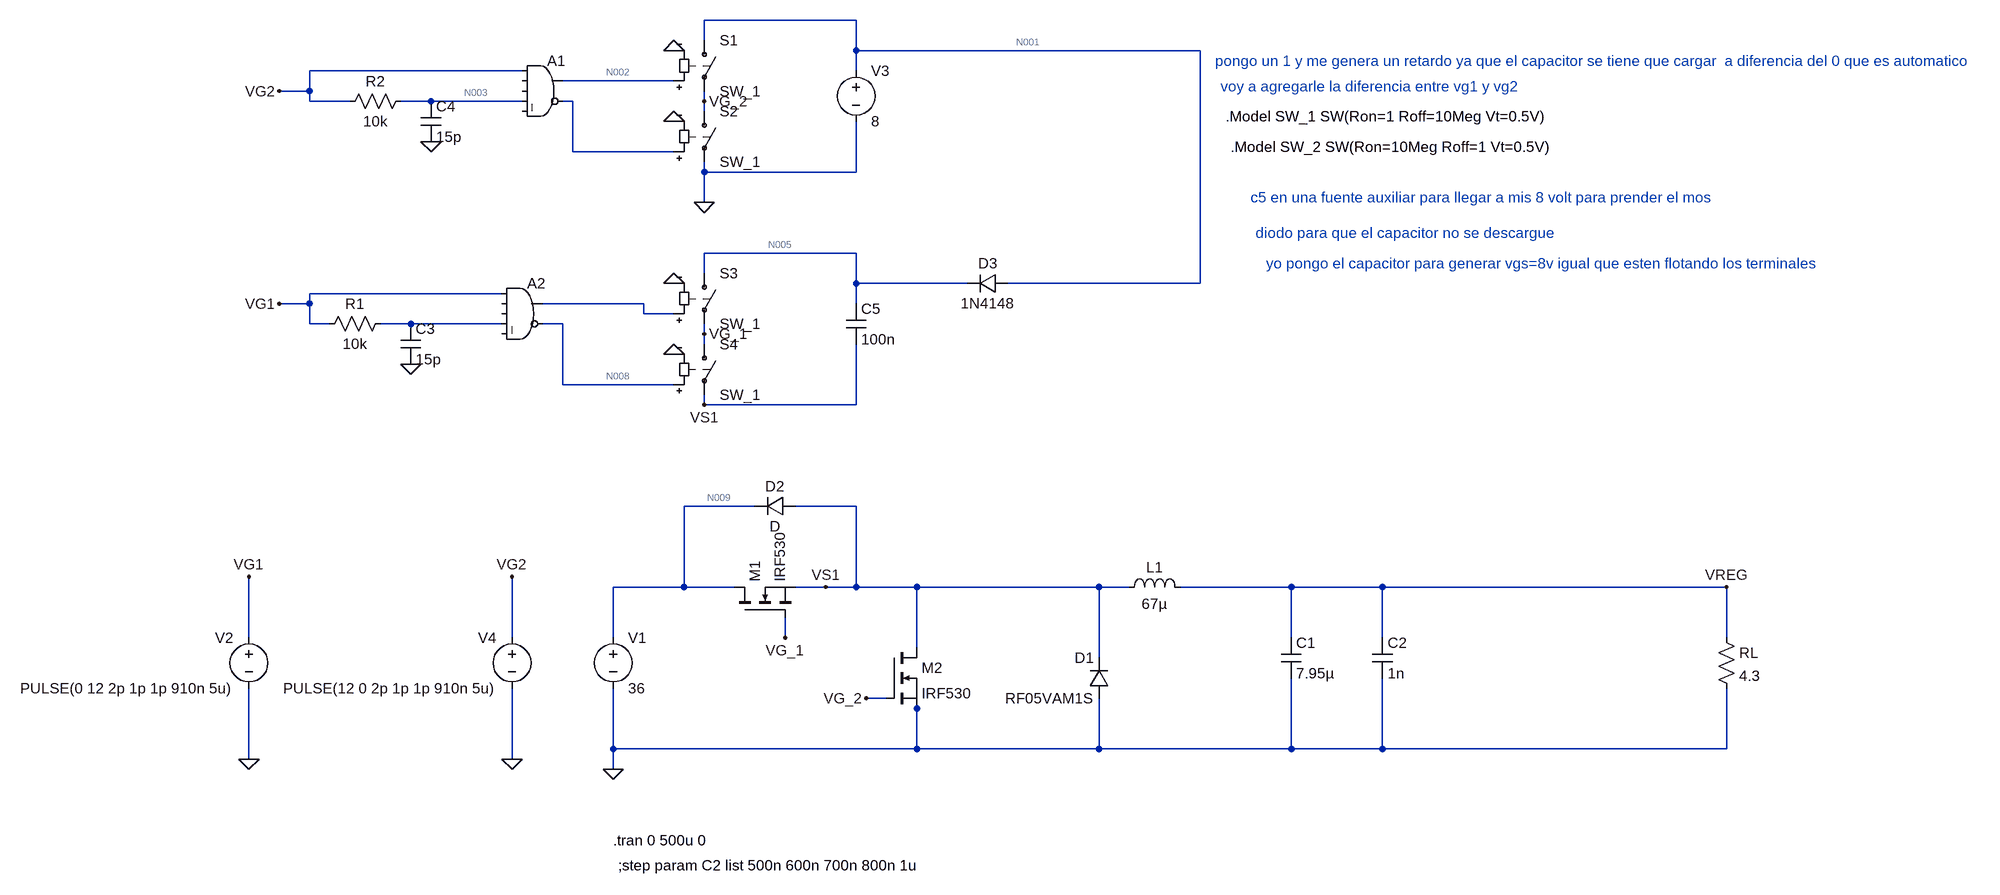
[diagram p0: schematic BUCK_v2.asc]
BUCK_v2.asc, the LTspice schematic file:
Version 4
SHEET 1 1932 728
WIRE -400 -784 -640 -784
WIRE -640 -752 -640 -784
WIRE -400 -736 -400 -784
WIRE 144 -736 -400 -736
WIRE -928 -704 -1264 -704
WIRE -400 -704 -400 -736
WIRE -688 -688 -864 -688
WIRE -1264 -672 -1264 -704
WIRE -1264 -672 -1312 -672
WIRE -1264 -656 -1264 -672
WIRE -1200 -656 -1264 -656
WIRE -1072 -656 -1120 -656
WIRE -928 -656 -1072 -656
WIRE -848 -656 -864 -656
WIRE -640 -656 -640 -672
WIRE -640 -640 -640 -656
WIRE -848 -576 -848 -656
WIRE -688 -576 -848 -576
WIRE -640 -544 -640 -560
WIRE -400 -544 -400 -624
WIRE -400 -544 -640 -544
WIRE -640 -496 -640 -544
WIRE -400 -416 -640 -416
WIRE -640 -384 -640 -416
WIRE -400 -368 -400 -416
WIRE -224 -368 -400 -368
WIRE 144 -368 144 -736
WIRE 144 -368 -160 -368
WIRE -960 -352 -1264 -352
WIRE -1264 -336 -1264 -352
WIRE -1264 -336 -1312 -336
WIRE -736 -336 -896 -336
WIRE -400 -336 -400 -368
WIRE -736 -320 -736 -336
WIRE -688 -320 -736 -320
WIRE -1264 -304 -1264 -336
WIRE -1232 -304 -1264 -304
WIRE -1104 -304 -1152 -304
WIRE -960 -304 -1104 -304
WIRE -864 -304 -896 -304
WIRE -640 -288 -640 -304
WIRE -640 -272 -640 -288
WIRE -864 -208 -864 -304
WIRE -688 -208 -864 -208
WIRE -640 -176 -640 -192
WIRE -400 -176 -400 -272
WIRE -400 -176 -640 -176
WIRE -560 -16 -672 -16
WIRE -400 -16 -496 -16
WIRE -672 112 -672 -16
WIRE -672 112 -784 112
WIRE -592 112 -672 112
WIRE -448 112 -496 112
WIRE -400 112 -400 -16
WIRE -400 112 -448 112
WIRE -304 112 -400 112
WIRE -16 112 -304 112
WIRE 32 112 -16 112
WIRE 288 112 112 112
WIRE 432 112 288 112
WIRE 976 112 432 112
WIRE -1360 192 -1360 96
WIRE -944 192 -944 96
WIRE -784 192 -784 112
WIRE -512 192 -512 160
WIRE 288 192 288 112
WIRE 432 192 432 112
WIRE 976 192 976 112
WIRE -304 208 -304 112
WIRE -16 224 -16 112
WIRE -352 288 -384 288
WIRE -304 304 -304 288
WIRE -784 368 -784 272
WIRE -304 368 -304 304
WIRE -304 368 -784 368
WIRE -16 368 -16 288
WIRE -16 368 -304 368
WIRE 288 368 288 256
WIRE 288 368 -16 368
WIRE 432 368 432 256
WIRE 432 368 288 368
WIRE 976 368 976 272
WIRE 976 368 432 368
WIRE -1360 384 -1360 272
WIRE -944 384 -944 272
WIRE -784 400 -784 368
FLAG -1360 384 0
FLAG -784 400 0
FLAG -1360 96 VG1
FLAG -512 192 VG_1
FLAG 976 112 VREG
FLAG -944 96 VG2
FLAG -944 384 0
FLAG -384 288 VG_2
FLAG -1104 -240 0
FLAG -1072 -592 0
FLAG -1312 -336 VG1
FLAG -1312 -672 VG2
FLAG -688 -624 0
FLAG -688 -736 0
FLAG -688 -256 0
FLAG -688 -368 0
FLAG -640 -288 VG_1
FLAG -640 -656 VG_2
FLAG -640 -496 0
FLAG -448 112 VS1
FLAG -640 -176 VS1
SYMBOL voltage -784 176 R0
WINDOW 123 0 0 Left 0
WINDOW 39 0 0 Left 0
SYMATTR InstName V1
SYMATTR Value 36
SYMBOL ind 16 128 R270
WINDOW 0 32 56 VTop 2
WINDOW 3 5 56 VBottom 2
SYMATTR InstName L1
SYMATTR Value 67µ
SYMBOL cap 272 192 R0
SYMATTR InstName C1
SYMATTR Value 7.95µ
SYMBOL nmos -592 160 R270
SYMATTR InstName M1
SYMATTR Value IRF530
SYMBOL voltage -1360 176 M0
WINDOW 123 0 0 Left 0
WINDOW 39 0 0 Left 0
SYMATTR InstName V2
SYMATTR Value PULSE(0 12 2p 1p 1p 910n 5u)
SYMBOL voltage -944 176 M0
WINDOW 123 0 0 Left 0
WINDOW 39 0 0 Left 0
SYMATTR InstName V4
SYMATTR Value PULSE(12 0 2p 1p 1p 910n 5u)
SYMBOL nmos -352 208 R0
SYMATTR InstName M2
SYMATTR Value IRF530
SYMBOL cap 416 192 R0
SYMATTR InstName C2
SYMATTR Value 1n
SYMBOL res 960 176 R0
SYMATTR InstName RL
SYMATTR Value 4.3
SYMBOL diode 0 288 R180
WINDOW 0 24 64 Left 2
WINDOW 3 24 0 Left 2
SYMATTR InstName D1
SYMATTR Value RF05VAM1S
SYMBOL diode -496 -32 R90
WINDOW 0 0 32 VBottom 2
WINDOW 3 32 32 VTop 2
SYMATTR InstName D2
SYMBOL Digital\\and -928 -384 R0
SYMATTR InstName A2
SYMBOL cap -1120 -304 R0
SYMATTR InstName C3
SYMATTR Value 15p
SYMBOL res -1136 -320 R90
WINDOW 0 0 56 VBottom 2
WINDOW 3 32 56 VTop 2
SYMATTR InstName R1
SYMATTR Value 10k
SYMBOL Digital\\and -896 -736 R0
SYMATTR InstName A1
SYMBOL cap -1088 -656 R0
SYMATTR InstName C4
SYMATTR Value 15p
SYMBOL res -1104 -672 R90
WINDOW 0 0 56 VBottom 2
WINDOW 3 32 56 VTop 2
SYMATTR InstName R2
SYMATTR Value 10k
SYMBOL sw -640 -768 R0
SYMATTR InstName S1
SYMATTR Value SW_1
SYMBOL sw -640 -656 R0
SYMATTR InstName S2
SYMATTR Value SW_1
SYMBOL voltage -400 -720 R0
WINDOW 123 0 0 Left 0
WINDOW 39 0 0 Left 0
SYMATTR InstName V3
SYMATTR Value 8
SYMBOL sw -640 -400 R0
SYMATTR InstName S3
SYMATTR Value SW_1
SYMBOL sw -640 -288 R0
SYMATTR InstName S4
SYMATTR Value SW_1
SYMBOL cap -416 -336 R0
SYMATTR InstName C5
SYMATTR Value 100n
SYMBOL diode -160 -384 R90
WINDOW 0 0 32 VBottom 2
WINDOW 3 32 32 VTop 2
SYMATTR InstName D3
SYMATTR Value 1N4148
TEXT -784 512 Left 2 !.tran 0 500u 0
TEXT -776 552 Left 2 !;step param C2 list 500n 600n 700n 800n 1u
TEXT 168 -720 Left 2 ;pongo un 1 y me genera un retardo ya que el capacitor se tiene que cargar  a diferencia del 0 que es automatico
TEXT 176 -680 Left 2 ;voy a agregarle la diferencia entre vg1 y vg2
TEXT 184 -632 Left 2 !.Model SW_1 SW(Ron=1 Roff=10Meg Vt=0.5V)
TEXT 192 -584 Left 2 !.Model SW_2 SW(Ron=10Meg Roff=1 Vt=0.5V)
TEXT 224 -504 Left 2 ;c5 en una fuente auxiliar para llegar a mis 8 volt para prender el mos
TEXT 232 -448 Left 2 ;diodo para que el capacitor no se descargue
TEXT 248 -400 Left 2 ;yo pongo el capacitor para generar vgs=8v igual que esten flotando los terminales

The netlist it stands for:
* BUCK_v2.asc
V1 N009 0 36
L1 VS1 VREG 67µ
C1 VREG 0 7.95µ
M1 N009 VG_1 VS1 VS1 IRF530
V2 VG1 0 PULSE(0 12 2p 1p 1p 910n 5u)
V4 VG2 0 PULSE(12 0 2p 1p 1p 910n 5u)
M2 VS1 VG_2 0 0 IRF530
C2 VREG 0 1n
RL VREG 0 4.3
D1 0 VS1 RF05VAM1S
D2 VS1 N009 D
A2 VG1 0 0 N007 0 N008 N006 0 AND
C3 N007 0 15p
R1 N007 VG1 10k
A1 VG2 0 0 N003 0 N004 N002 0 AND
C4 N003 0 15p
R2 N003 VG2 10k
S1 N001 VG_2 N002 0 SW_1
S2 VG_2 0 N004 0 SW_1
V3 N001 0 8
S3 N005 VG_1 N006 0 SW_1
S4 VG_1 VS1 N008 0 SW_1
C5 N005 VS1 100n
D3 N001 N005 1N4148
.model D D
.lib standard.dio
.model NMOS NMOS
.model PMOS PMOS
.lib standard.mos
.tran 0 500u 0
;step param C2 list 500n 600n 700n 800n 1u
* pongo un 1 y me genera un retardo ya que el capacitor se tiene que cargar  a diferencia del 0 que es automatico
* voy a agregarle la diferencia entre vg1 y vg2
.Model SW_1 SW(Ron=1 Roff=10Meg Vt=0.5V)
.Model SW_2 SW(Ron=10Meg Roff=1 Vt=0.5V)
* c5 en una fuente auxiliar para llegar a mis 8 volt para prender el mos
* diodo para que el capacitor no se descargue
* yo pongo el capacitor para generar vgs=8v igual que esten flotando los terminales
.backanno
.end

* Results of the author's LTspice run, read from the files saved beside the schematic
* Operating Point, zero values left out:
*   V(n009) = 36 V
*   V(vs1) = 84.5 nV
*   V(vreg) = 84.48 nV
*   V(vg_1) = 858.5 nV
*   V(vg2) = 12 V
*   V(vg_2) = 8 V
*   V(n008) = 1 V
*   V(n003) = 12 V
*   V(n002) = 1 V
*   V(n001) = 8 V
*   V(n005) = 7.74 V
*   Id(M2) = 754.4 nA
*   Is(M2) = -754.4 nA
*   Id(M1) = 87.87 pA
*   Is(M1) = -87.87 pA
*   I(D3) = 774 nA
*   I(D2) = -36.01 pA
*   I(L1) = 19.65 nA
*   I(Rl) = 19.65 nA
*   I(S4) = -774 nA
*   I(S3) = -774 nA
*   I(S2) = -800 nA
*   I(S1) = -800 nA
*   I(V3) = -1.574 µA
*   I(V1) = -160 pA